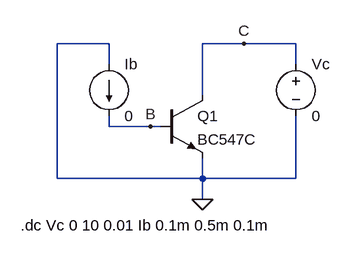
[diagram p0: schematic bc547_dc.asc]
bc547_dc.asc, the LTspice schematic file:
Version 4
SHEET 1 880 680
WIRE 80 48 0 48
WIRE 288 48 224 48
WIRE 368 48 288 48
WIRE 80 80 80 48
WIRE 368 80 368 48
WIRE 224 128 224 48
WIRE 80 176 80 160
WIRE 144 176 80 176
WIRE 160 176 144 176
WIRE 0 256 0 48
WIRE 224 256 224 224
WIRE 224 256 0 256
WIRE 368 256 368 160
WIRE 368 256 224 256
WIRE 224 288 224 256
FLAG 224 288 0
FLAG 288 48 C
FLAG 144 176 B
SYMBOL npn2 160 128 R0
SYMATTR InstName Q1
SYMATTR Value BC547C
SYMBOL voltage 368 64 R0
SYMATTR InstName Vc
SYMATTR Value 0
SYMBOL current 80 80 R0
SYMATTR InstName Ib
SYMATTR Value 0
TEXT -56 328 Left 2 !.dc Vc 0 10 0.01 Ib 0.1m 0.5m 0.1m

The netlist it stands for:
* bc547_dc.asc
Q1 C B 0 0 BC547C
Vc C 0 0
Ib 0 B 0
.model NPN NPN
.model PNP PNP
.lib standard.bjt
.dc Vc 0 10 0.01 Ib 0.1m 0.5m 0.1m
.backanno
.end